# Altium schematic sheet 19_SOLENOID_HB_1.SchDoc
size 420 x 297 mm; SheetNumber: 31; SheetTotal: 36
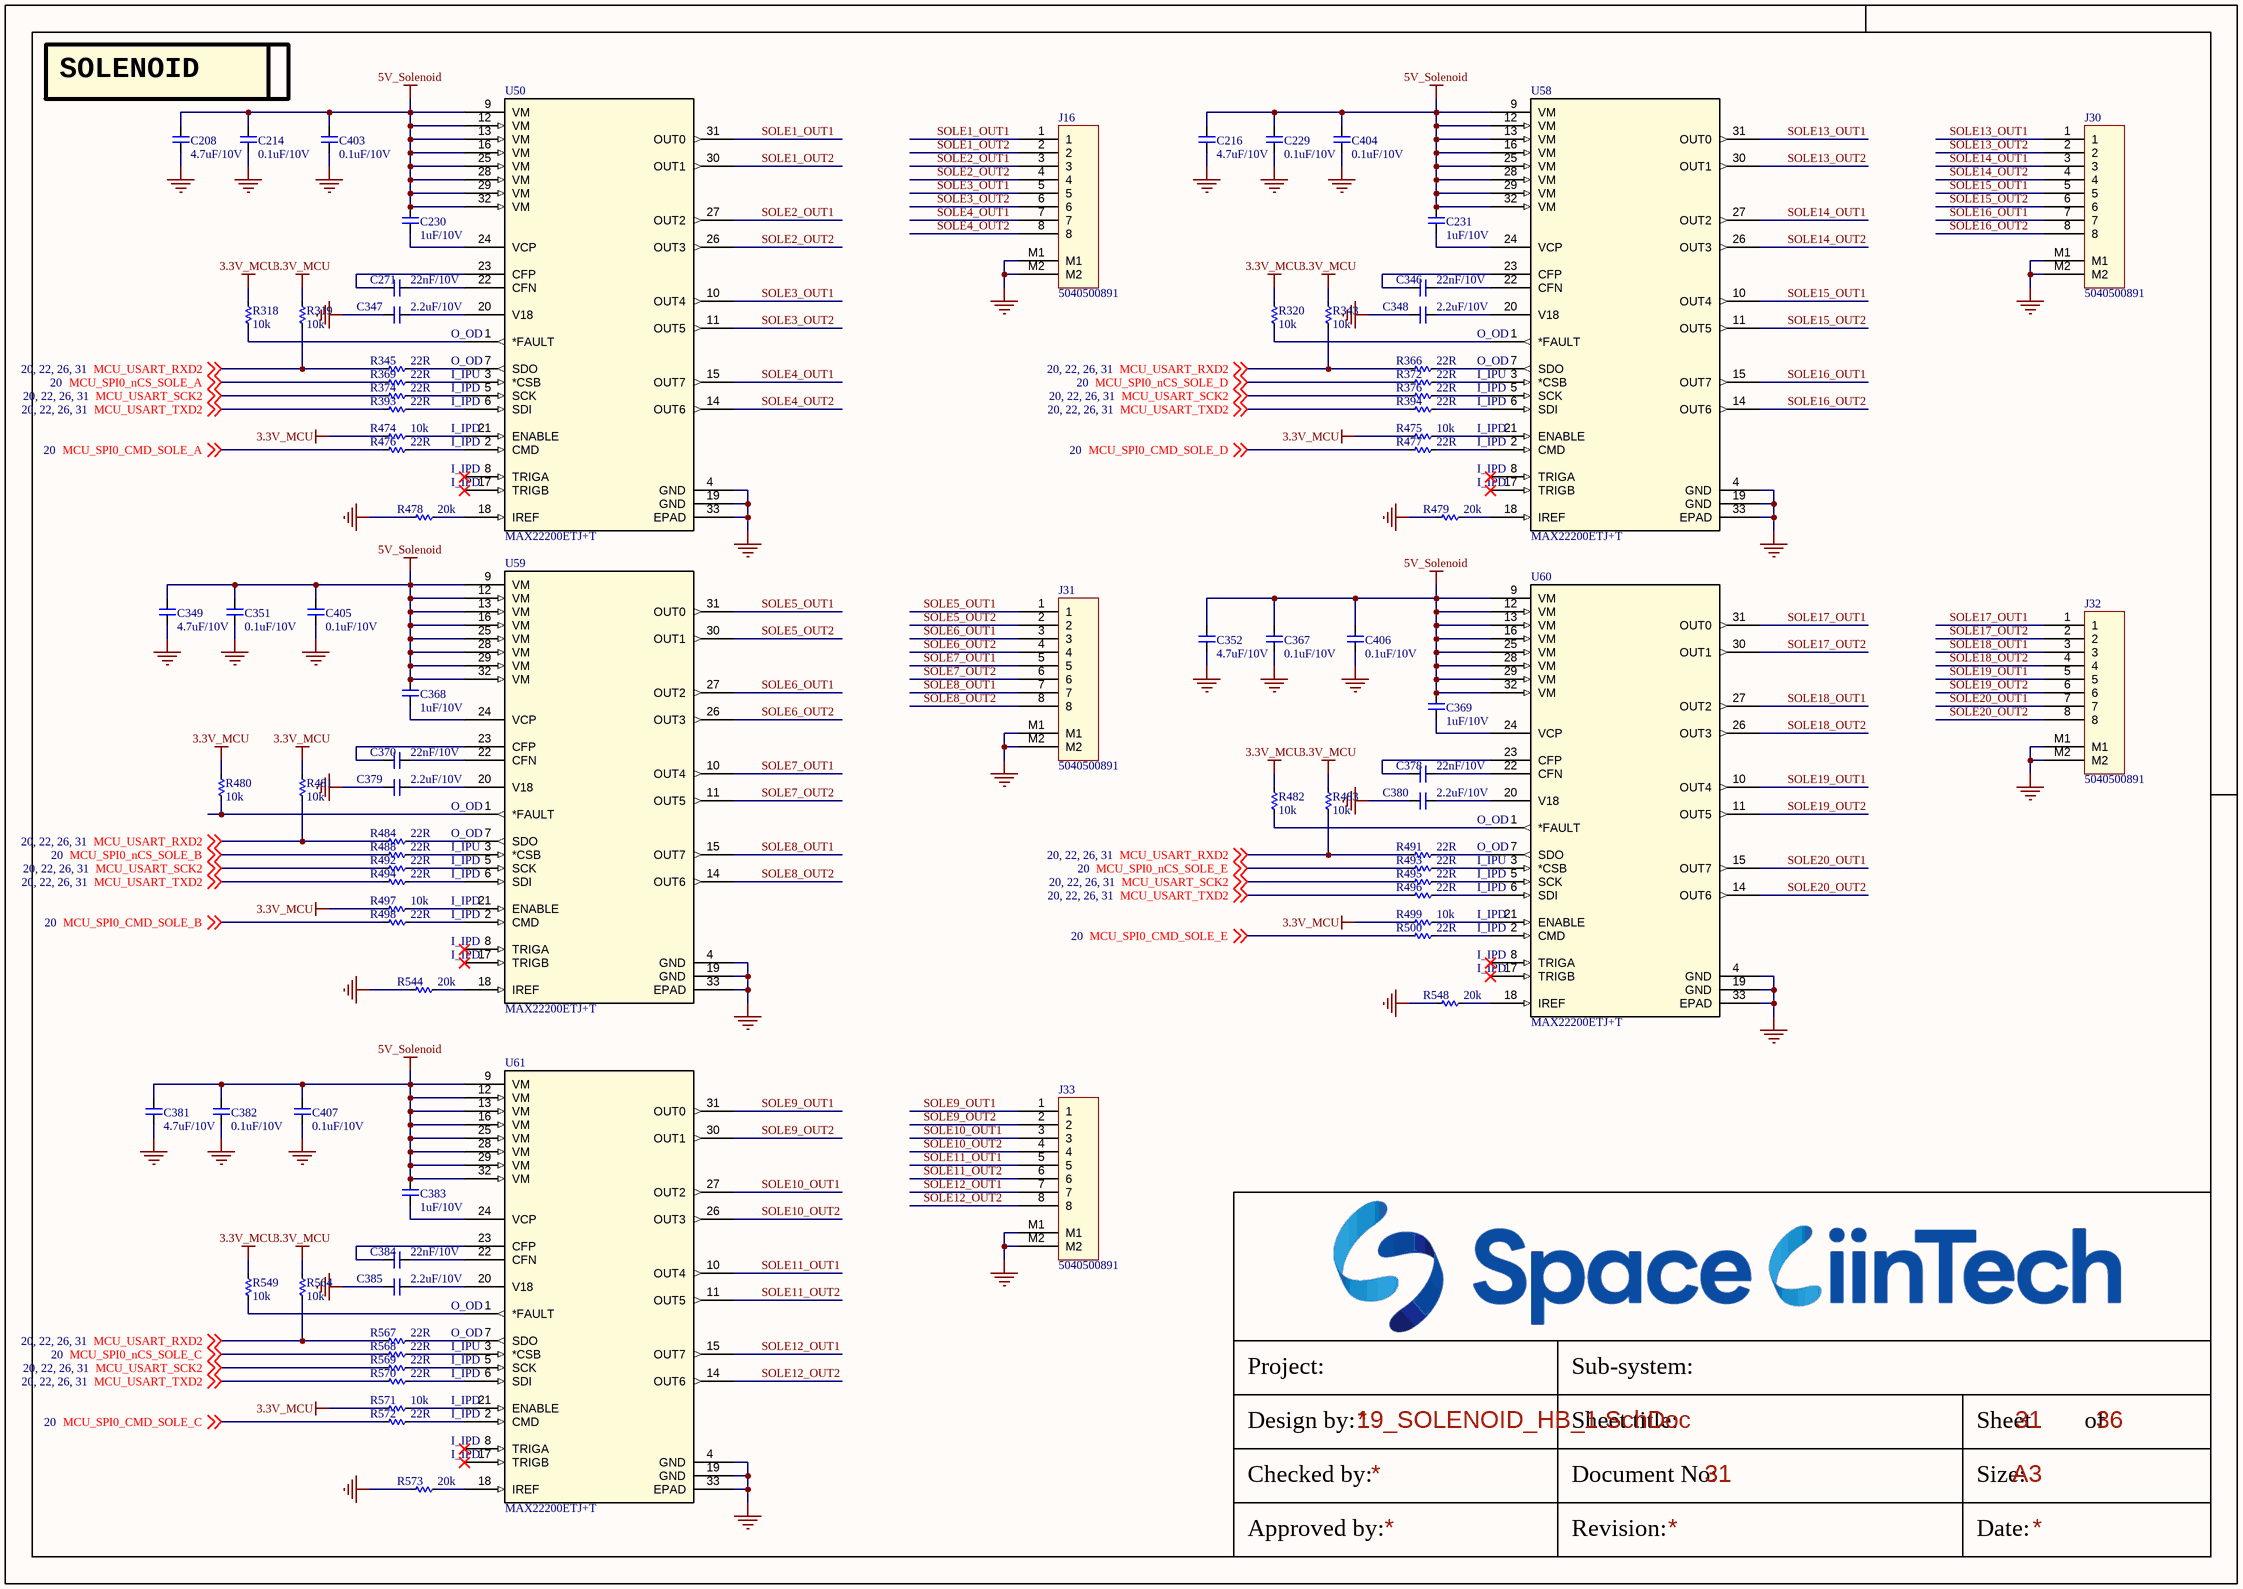
[diagram p0: 19_SOLENOID_HB_1.SchDoc]

## Parts
C208  4.7uF/10V  [CAP_C_1005X60]
C214  0.1uF/10V  [CAP_C_1005X60]
C216  4.7uF/10V  [CAP_C_1005X60]
C229  0.1uF/10V  [CAP_C_1005X60]
C230  1uF/10V  [CAP_C_1005X60]
C231  1uF/10V  [CAP_C_1005X60]
C271  22nF/10V  [CAP_C_1005X60]
C346  22nF/10V  [CAP_C_1005X60]
C347  2.2uF/10V  [CAP_C_1005X60]
C348  2.2uF/10V  [CAP_C_1005X60]
C349  4.7uF/10V  [CAP_C_1005X60]
C351  0.1uF/10V  [CAP_C_1005X60]
C352  4.7uF/10V  [CAP_C_1005X60]
C367  0.1uF/10V  [CAP_C_1005X60]
C368  1uF/10V  [CAP_C_1005X60]
C369  1uF/10V  [CAP_C_1005X60]
C370  22nF/10V  [CAP_C_1005X60]
C378  22nF/10V  [CAP_C_1005X60]
C379  2.2uF/10V  [CAP_C_1005X60]
C380  2.2uF/10V  [CAP_C_1005X60]
C381  4.7uF/10V  [CAP_C_1005X60]
C382  0.1uF/10V  [CAP_C_1005X60]
C383  1uF/10V  [CAP_C_1005X60]
C384  22nF/10V  [CAP_C_1005X60]
C385  2.2uF/10V  [CAP_C_1005X60]
C403  0.1uF/10V  [CAP_C_1005X60]
C404  0.1uF/10V  [CAP_C_1005X60]
C405  0.1uF/10V  [CAP_C_1005X60]
C406  0.1uF/10V  [CAP_C_1005X60]
C407  0.1uF/10V  [CAP_C_1005X60]
J16  5040500891  [MOLEX_5040500891]
J30  5040500891  [MOLEX_5040500891]
J31  5040500891  [MOLEX_5040500891]
J32  5040500891  [MOLEX_5040500891]
J33  5040500891  [MOLEX_5040500891]
R318  10k  [RES_C_1005X40]
R319  10k  [RES_C_1005X40]
R320  10k  [RES_C_1005X40]
R343  10k  [RES_C_1005X40]
R345  22R  [RES_C_1005X40]
R366  22R  [RES_C_1005X40]
R369  22R  [RES_C_1005X40]
R372  22R  [RES_C_1005X40]
R374  22R  [RES_C_1005X40]
R376  22R  [RES_C_1005X40]
R393  22R  [RES_C_1005X40]
R394  22R  [RES_C_1005X40]
R474  10k  [RES_C_1005X40]
R475  10k  [RES_C_1005X40]
R476  22R  [RES_C_1005X40]
R477  22R  [RES_C_1005X40]
R478  20k  [RES_C_1005X40]
R479  20k  [RES_C_1005X40]
R480  10k  [RES_C_1005X40]
R481  10k  [RES_C_1005X40]
R482  10k  [RES_C_1005X40]
R483  10k  [RES_C_1005X40]
R484  22R  [RES_C_1005X40]
R488  22R  [RES_C_1005X40]
R491  22R  [RES_C_1005X40]
R492  22R  [RES_C_1005X40]
R493  22R  [RES_C_1005X40]
R494  22R  [RES_C_1005X40]
R495  22R  [RES_C_1005X40]
R496  22R  [RES_C_1005X40]
R497  10k  [RES_C_1005X40]
R498  22R  [RES_C_1005X40]
R499  10k  [RES_C_1005X40]
R500  22R  [RES_C_1005X40]
R544  20k  [RES_C_1005X40]
R548  20k  [RES_C_1005X40]
R549  10k  [RES_C_1005X40]
R564  10k  [RES_C_1005X40]
R567  22R  [RES_C_1005X40]
R568  22R  [RES_C_1005X40]
R569  22R  [RES_C_1005X40]
R570  22R  [RES_C_1005X40]
R571  10k  [RES_C_1005X40]
R572  22R  [RES_C_1005X40]
R573  20k  [RES_C_1005X40]
U50  MAX22200ETJ+T  [21-0140AK_T3255_8C_MXM]
U58  MAX22200ETJ+T  [21-0140AK_T3255_8C_MXM]
U59  MAX22200ETJ+T  [21-0140AK_T3255_8C_MXM]
U60  MAX22200ETJ+T  [21-0140AK_T3255_8C_MXM]
U61  MAX22200ETJ+T  [21-0140AK_T3255_8C_MXM]

## Nets
3.3V_MCU: R318.1 R319.1 R320.1 R343.1 R474.1 R475.1 R480.1 R481.1 R482.1 R483.1 R497.1 R499.1 R549.1 R564.1 R571.1
5V_Solenoid: C208.2 C214.2 C216.2 C229.2 C230.2 C231.2 C349.2 C351.2 C352.2 C367.2 C368.2 C369.2 C381.2 C382.2 C383.2 C403.2 C404.2 C405.2 C406.2 C407.2 U50.9(VM) U50.12(VM) U50.13(VM) U50.16(VM) U50.25(VM) U50.28(VM) U50.29(VM) U50.32(VM) U58.9(VM) U58.12(VM) U58.13(VM) U58.16(VM) U58.25(VM) U58.28(VM) U58.29(VM) U58.32(VM) U59.9(VM) U59.12(VM) U59.13(VM) U59.16(VM) U59.25(VM) U59.28(VM) U59.29(VM) U59.32(VM) U60.9(VM) U60.12(VM) U60.13(VM) U60.16(VM) U60.25(VM) U60.28(VM) U60.29(VM) U60.32(VM) U61.9(VM) U61.12(VM) U61.13(VM) U61.16(VM) U61.25(VM) U61.28(VM) U61.29(VM) U61.32(VM)
GND: C208.1 C214.1 C216.1 C229.1 C347.1 C348.1 C349.1 C351.1 C352.1 C367.1 C379.1 C380.1 C381.1 C382.1 C385.1 C403.1 C404.1 C405.1 C406.1 C407.1 J16.M1 J16.M2 J30.M1 J30.M2 J31.M1 J31.M2 J32.M1 J32.M2 J33.M1 J33.M2 R478.1 R479.1 R544.1 R548.1 R573.1 U50.4(GND) U50.19(GND) U50.33(EPAD) U58.4(GND) U58.19(GND) U58.33(EPAD) U59.4(GND) U59.19(GND) U59.33(EPAD) U60.4(GND) U60.19(GND) U60.33(EPAD) U61.4(GND) U61.19(GND) U61.33(EPAD)
MCU_SPI0_CMD_SOLE_A: R476.1 ; off-sheet MCU_SPI0_CMD_SOLE_A
MCU_SPI0_CMD_SOLE_B: R498.1 ; off-sheet MCU_SPI0_CMD_SOLE_B
MCU_SPI0_CMD_SOLE_C: R572.1 ; off-sheet MCU_SPI0_CMD_SOLE_C
MCU_SPI0_CMD_SOLE_D: R477.1 ; off-sheet MCU_SPI0_CMD_SOLE_D
MCU_SPI0_CMD_SOLE_E: R500.1 ; off-sheet MCU_SPI0_CMD_SOLE_E
MCU_SPI0_nCS_SOLE_A: R369.1 ; off-sheet MCU_SPI0_nCS_SOLE_A
MCU_SPI0_nCS_SOLE_B: R488.1 ; off-sheet MCU_SPI0_nCS_SOLE_B
MCU_SPI0_nCS_SOLE_C: R568.1 ; off-sheet MCU_SPI0_nCS_SOLE_C
MCU_SPI0_nCS_SOLE_D: R372.1 ; off-sheet MCU_SPI0_nCS_SOLE_D
MCU_SPI0_nCS_SOLE_E: R493.1 ; off-sheet MCU_SPI0_nCS_SOLE_E
MCU_USART_RXD2: R319.2 R343.2 R345.1 R366.1 R481.2 R483.2 R484.1 R491.1 R564.2 R567.1 ; off-sheet MCU_USART_RXD2
MCU_USART_SCK2: R374.1 R376.1 R492.1 R495.1 R569.1 ; off-sheet MCU_USART_SCK2
MCU_USART_TXD2: R393.1 R394.1 R494.1 R496.1 R570.1 ; off-sheet MCU_USART_TXD2
SOLE1_OUT1: J16.1 U50.31(OUT0)
SOLE1_OUT2: J16.2 U50.30(OUT1)
SOLE2_OUT1: J16.3 U50.27(OUT2)
SOLE2_OUT2: J16.4 U50.26(OUT3)
SOLE3_OUT1: J16.5 U50.10(OUT4)
SOLE3_OUT2: J16.6 U50.11(OUT5)
SOLE4_OUT1: J16.7 U50.15(OUT7)
SOLE4_OUT2: J16.8 U50.14(OUT6)
SOLE5_OUT1: J31.1 U59.31(OUT0)
SOLE5_OUT2: J31.2 U59.30(OUT1)
SOLE6_OUT1: J31.3 U59.27(OUT2)
SOLE6_OUT2: J31.4 U59.26(OUT3)
SOLE7_OUT1: J31.5 U59.10(OUT4)
SOLE7_OUT2: J31.6 U59.11(OUT5)
SOLE8_OUT1: J31.7 U59.15(OUT7)
SOLE8_OUT2: J31.8 U59.14(OUT6)
SOLE9_OUT1: J33.1 U61.31(OUT0)
SOLE9_OUT2: J33.2 U61.30(OUT1)
SOLE10_OUT1: J33.3 U61.27(OUT2)
SOLE10_OUT2: J33.4 U61.26(OUT3)
SOLE11_OUT1: J33.5 U61.10(OUT4)
SOLE11_OUT2: J33.6 U61.11(OUT5)
SOLE12_OUT1: J33.7 U61.15(OUT7)
SOLE12_OUT2: J33.8 U61.14(OUT6)
SOLE13_OUT1: J30.1 U58.31(OUT0)
SOLE13_OUT2: J30.2 U58.30(OUT1)
SOLE14_OUT1: J30.3 U58.27(OUT2)
SOLE14_OUT2: J30.4 U58.26(OUT3)
SOLE15_OUT1: J30.5 U58.10(OUT4)
SOLE15_OUT2: J30.6 U58.11(OUT5)
SOLE16_OUT1: J30.7 U58.15(OUT7)
SOLE16_OUT2: J30.8 U58.14(OUT6)
SOLE17_OUT1: J32.1 U60.31(OUT0)
SOLE17_OUT2: J32.2 U60.30(OUT1)
SOLE18_OUT1: J32.3 U60.27(OUT2)
SOLE18_OUT2: J32.4 U60.26(OUT3)
SOLE19_OUT1: J32.5 U60.10(OUT4)
SOLE19_OUT2: J32.6 U60.11(OUT5)
SOLE20_OUT1: J32.7 U60.15(OUT7)
SOLE20_OUT2: J32.8 U60.14(OUT6)
NetC230_1: C230.1 U50.24(VCP)
NetC231_1: C231.1 U58.24(VCP)
NetC271_1: C271.1 U50.22(CFN)
NetC271_2: C271.2 U50.23(CFP)
NetC346_1: C346.1 U58.22(CFN)
NetC346_2: C346.2 U58.23(CFP)
NetC347_2: C347.2 U50.20(V18)
NetC348_2: C348.2 U58.20(V18)
NetC368_1: C368.1 U59.24(VCP)
NetC369_1: C369.1 U60.24(VCP)
NetC370_1: C370.1 U59.22(CFN)
NetC370_2: C370.2 U59.23(CFP)
NetC378_1: C378.1 U60.22(CFN)
NetC378_2: C378.2 U60.23(CFP)
NetC379_2: C379.2 U59.20(V18)
NetC380_2: C380.2 U60.20(V18)
NetC383_1: C383.1 U61.24(VCP)
NetC384_1: C384.1 U61.22(CFN)
NetC384_2: C384.2 U61.23(CFP)
NetC385_2: C385.2 U61.20(V18)
NetR318_2: R318.2 U50.1(*FAULT)
NetR320_2: R320.2 U58.1(*FAULT)
NetR345_2: R345.2 U50.7(SDO)
NetR366_2: R366.2 U58.7(SDO)
NetR369_2: R369.2 U50.3(*CSB)
NetR372_2: R372.2 U58.3(*CSB)
NetR374_2: R374.2 U50.5(SCK)
NetR376_2: R376.2 U58.5(SCK)
NetR393_2: R393.2 U50.6(SDI)
NetR394_2: R394.2 U58.6(SDI)
NetR474_2: R474.2 U50.21(ENABLE)
NetR475_2: R475.2 U58.21(ENABLE)
NetR476_2: R476.2 U50.2(CMD)
NetR477_2: R477.2 U58.2(CMD)
NetR478_2: R478.2 U50.18(IREF)
NetR479_2: R479.2 U58.18(IREF)
NetR480_2: R480.2 U59.1(*FAULT)
NetR482_2: R482.2 U60.1(*FAULT)
NetR484_2: R484.2 U59.7(SDO)
NetR488_2: R488.2 U59.3(*CSB)
NetR491_2: R491.2 U60.7(SDO)
NetR492_2: R492.2 U59.5(SCK)
NetR493_2: R493.2 U60.3(*CSB)
NetR494_2: R494.2 U59.6(SDI)
NetR495_2: R495.2 U60.5(SCK)
NetR496_2: R496.2 U60.6(SDI)
NetR497_2: R497.2 U59.21(ENABLE)
NetR498_2: R498.2 U59.2(CMD)
NetR499_2: R499.2 U60.21(ENABLE)
NetR500_2: R500.2 U60.2(CMD)
NetR544_2: R544.2 U59.18(IREF)
NetR548_2: R548.2 U60.18(IREF)
NetR549_2: R549.2 U61.1(*FAULT)
NetR567_2: R567.2 U61.7(SDO)
NetR568_2: R568.2 U61.3(*CSB)
NetR569_2: R569.2 U61.5(SCK)
NetR570_2: R570.2 U61.6(SDI)
NetR571_2: R571.2 U61.21(ENABLE)
NetR572_2: R572.2 U61.2(CMD)
NetR573_2: R573.2 U61.18(IREF)

Not connected (* = marked no-connect by the designer): U50 8(TRIGA)* 17(TRIGB)*; U58 8(TRIGA)* 17(TRIGB)*; U59 8(TRIGA)* 17(TRIGB)*; U60 8(TRIGA)* 17(TRIGB)*; U61 8(TRIGA)* 17(TRIGB)*

## Notes on the sheet
- (near C208) SOLENOID
- O_OD
- (near U50) I_IPU
- (near U50) I_IPD
- (near U50) O_OD
- (near U58) I_IPU
- (near U58) I_IPD
- (near U58) O_OD
- I_IPD
- (near U59) I_IPU
- (near U59) I_IPD
- (near U59) O_OD
- (near U60) I_IPU
- (near U60) O_OD
- (near U60) I_IPD
- (near U61) O_OD
- (near U61) I_IPU
- (near U61) I_IPD
- Project:
- Sub-system:
- Design by:
- Sheet title:
- Sheet
- of
- Checked by:
- Approved by:
- Revision:
- Document No:
- Size:
- Date:
- A3

## Library data of the parts
C208 C214 C216 C229-C231 C271 C346-C349 C351 C352 C367-C370 C378-C385 C403-C407 = _CAP_C_2: CAP CHIP
J16 J30-J33 = Header 8x1_2M
R318-R320 R343 R345 R366 R369 R372 R374 R376 R393 R394 R474-R484 R488 R491-R500 R544 R548 R549 R564 R567-R573 = _RES_B_2: RES
U50 U58-U61 = MAX22200ETJ+T: 36V, 1A Octal Integrated Serial-Controlled Solenoid and Motor Driver; Manufacturer_Name: Analog Devices Inc; Copyright: Copyright (C) 2026 Ultra Librarian. All rights reserved.; Manufacturer_Part_Number: MAX22200ETJ+T; RefDes: RefDes; Type: Type